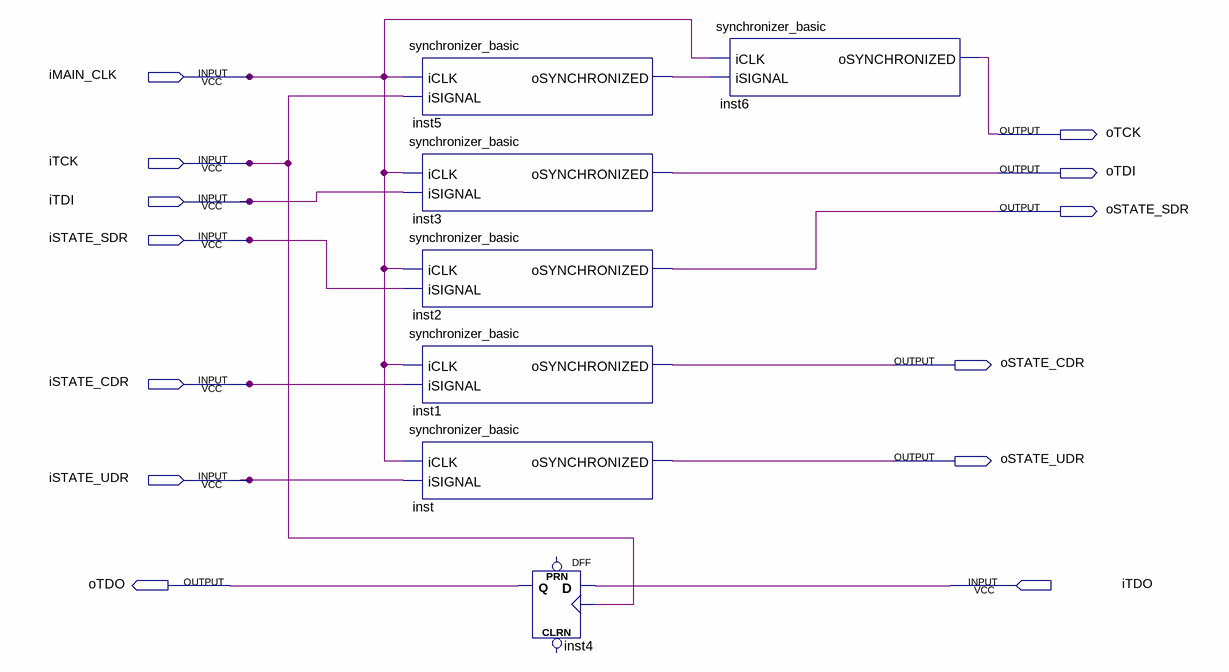
[diagram p0: schematic sheet]
// Quartus schematic jtag_synchronizer.bdf as structural Verilog: 7 symbols, 13 pins
module jtag_synchronizer (
  input  iMAIN_CLK,
  input  iTCK,
  input  iTDI,
  input  iSTATE_SDR,
  input  iSTATE_CDR,
  input  iSTATE_UDR,
  input  iTDO,
  output oTCK,
  output oTDI,
  output oSTATE_SDR,
  output oSTATE_CDR,
  output oSTATE_UDR,
  output oTDO
);

  wire inst5_osynchronized;

  synchronizer_basic inst5 (.iCLK(iMAIN_CLK), .iSIGNAL(iTCK), .oSYNCHRONIZED(inst5_osynchronized));
  synchronizer_basic inst3 (.iCLK(iMAIN_CLK), .iSIGNAL(iTDI), .oSYNCHRONIZED(oTDI));
  synchronizer_basic inst2 (.iCLK(iMAIN_CLK), .iSIGNAL(iSTATE_SDR), .oSYNCHRONIZED(oSTATE_SDR));
  synchronizer_basic inst1 (.iCLK(iMAIN_CLK), .iSIGNAL(iSTATE_CDR), .oSYNCHRONIZED(oSTATE_CDR));
  synchronizer_basic inst (.iCLK(iMAIN_CLK), .iSIGNAL(iSTATE_UDR), .oSYNCHRONIZED(oSTATE_UDR));
  DFF inst4 (.CLK(iTCK), .D(iTDO), .Q(oTDO));  // open: CLRN, PRN
  synchronizer_basic inst6 (.iCLK(iMAIN_CLK), .iSIGNAL(inst5_osynchronized), .oSYNCHRONIZED(oTCK));
endmodule
